# EAGLE design Adafruit Ethernet FeatherWing (EAGLE 6.4)
COMPANY: ADAFRUIT INDUSTRIES; DRAWN: KTOWN; REV: B
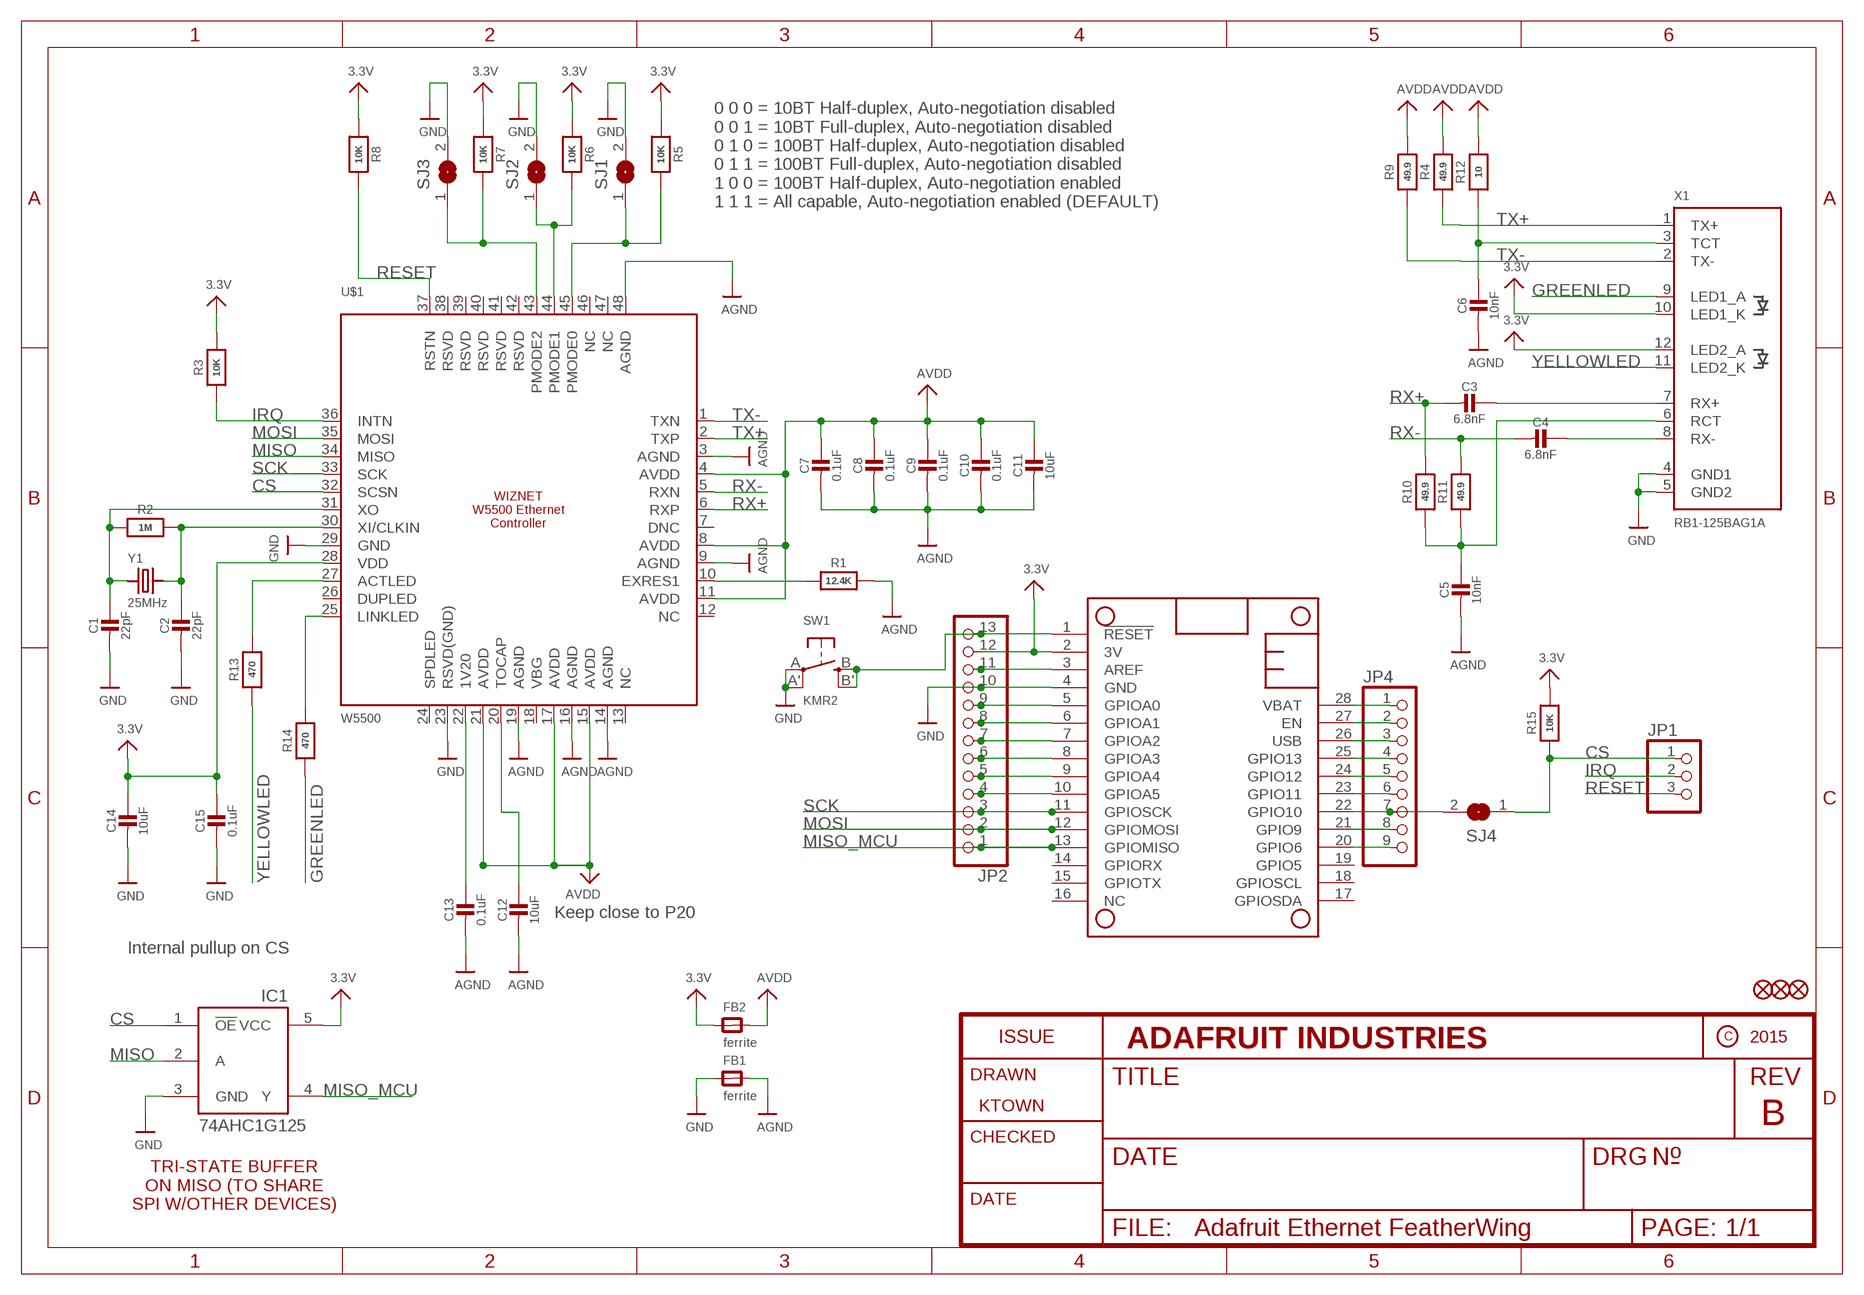
[diagram p0: schematic, sheet 1]

## Parts
C1  22pF  CAP_CERAMIC0603_NO  [0603-NO]
C2  22pF  CAP_CERAMIC0603_NO  [0603-NO]
C3  6.8nF  CAP_CERAMIC0603_NO  [0603-NO]
C4  6.8nF  CAP_CERAMIC0603_NO  [0603-NO]
C5  10nF  CAP_CERAMIC0603_NO  [0603-NO]
C6  10nF  CAP_CERAMIC0603_NO  [0603-NO]
C7  0.1uF  CAP_CERAMIC0603_NO  [0603-NO]
C8  0.1uF  CAP_CERAMIC0603_NO  [0603-NO]
C9  0.1uF  CAP_CERAMIC0603_NO  [0603-NO]
C10  0.1uF  CAP_CERAMIC0603_NO  [0603-NO]
C11  10uF  CAP_CERAMIC0805-NOOUTLINE  [0805-NO]
C12  10uF  CAP_CERAMIC0805-NOOUTLINE  [0805-NO]
C13  0.1uF  CAP_CERAMIC0603_NO  [0603-NO]
C14  10uF  CAP_CERAMIC0805-NOOUTLINE  [0805-NO]
C15  0.1uF  CAP_CERAMIC0603_NO  [0603-NO]
FB1  ferrite  FERRITE-0805NO  [0805-NO]
FB2  ferrite  FERRITE-0805NO  [0805-NO]
FID1  FIDUCIAL""  [FIDUCIAL_1MM]
FID2  FIDUCIAL""  [FIDUCIAL_1MM]
FID3  FIDUCIAL""  [FIDUCIAL_1MM]
IC1  74AHC1G125  [SOT23-5L]
JP1  HEADER-1X376MIL  [1X03_ROUND_76]
JP2  HEADER-1X13  [1X13_ROUND_70]
JP4  HEADER-1X970MIL  [1X09_ROUND_70]
MS1  FEATHERWING_NODIM  [FEATHERWING_NODIM]
R1  12.4K  RESISTOR_0603_NOOUT  [0603-NO]
R2  1M  RESISTOR_0603_NOOUT  [0603-NO]
R3  10K  RESISTOR_0603_NOOUT  [0603-NO]
R4  49.9  RESISTOR_0603_NOOUT  [0603-NO]
R5  10K  RESISTOR_0603_NOOUT  [0603-NO]
R6  10K  RESISTOR_0603_NOOUT  [0603-NO]
R7  10K  RESISTOR_0603_NOOUT  [0603-NO]
R8  10K  RESISTOR_0603_NOOUT  [0603-NO]
R9  49.9  RESISTOR_0603_NOOUT  [0603-NO]
R10  49.9  RESISTOR_0603_NOOUT  [0603-NO]
R11  49.9  RESISTOR_0603_NOOUT  [0603-NO]
R12  10  RESISTOR_0603_NOOUT  [0603-NO]
R13  470  RESISTOR_0603_NOOUT  [0603-NO]
R14  470  RESISTOR_0603_NOOUT  [0603-NO]
R15  10K  RESISTOR_0603_NOOUT  [0603-NO]
SJ1  SOLDERJUMPERREFLOW_NOPASTE  [SOLDERJUMPER_REFLOW_NOPASTE]
SJ2  SOLDERJUMPERREFLOW_NOPASTE  [SOLDERJUMPER_REFLOW_NOPASTE]
SJ3  SOLDERJUMPERREFLOW_NOPASTE  [SOLDERJUMPER_REFLOW_NOPASTE]
SJ4  SOLDERJUMPERCLOSED  [SOLDERJUMPER_CLOSEDWIRE]
SW1  KMR2  SWITCH_TACT_SMT4.6X2.8  [BTN_KMR2_4.6X2.8]
U$1  W5500  WIZNET_W5500  [LQFP48]
X1  RB1-125BAG1A  RJ45J0026D21BNL  [RJ45_PULSEJACK]
Y1  25MHz  CRYSTAL3.2X2.5  [CRYSTAL_3.2X2.5]

## Nets
3.3V: C14.1 C15.1 FB2.1 IC1.5(VCC) JP2.12 MS1.2(3V) R3.2 R5.1 R6.1 R7.1 R8.1 R15.2 U$1.28(VDD) X1.10(LED1_K) X1.12(LED2_A)
AGND: C5.2 C6.2 C7.2 C8.2 C9.2 C10.2 C11.2 C12.2 C13.2 FB1.2 R1.2 U$1.3(AGND) U$1.9(AGND) U$1.14(AGND) U$1.16(AGND) U$1.19(AGND) U$1.48(AGND)
AVDD: C7.1 C8.1 C9.1 C10.1 C11.1 FB2.2 R4.2 R9.2 R12.2 U$1.4(AVDD) U$1.8(AVDD) U$1.11(AVDD) U$1.15(AVDD) U$1.17(AVDD) U$1.21(AVDD)
CS: IC1.1(!OE) JP1.1 R15.1 SJ4.1 U$1.32(SCSN)
GND: C1.2 C2.2 C14.2 C15.2 FB1.1 IC1.3(GND) JP2.10 MS1.4(GND) SJ1.2 SJ2.2 SJ3.2 SW1.A'(P1) SW1.A(P) U$1.23(RSVD(GND)) U$1.29(GND) X1.4(GND1) X1.5(GND2)
GREENLED: R14.1 X1.9(LED1_A)
IRQ: JP1.2 R3.1 U$1.36(INTN)
MISO: IC1.2(A) U$1.34(MISO)
MISO_MCU: IC1.4(Y) JP2.1 MS1.13(GPIOMISO)
MOSI: JP2.2 MS1.12(GPIOMOSI) U$1.35(MOSI)
N$1: C1.1 R2.1 U$1.31(XO) Y1.1
N$2: C2.1 R2.2 U$1.30(XI/CLKIN) Y1.2
N$3: R1.1 U$1.10(EXRES1)
N$4: R5.2 SJ1.1 U$1.45(PMODE0)
N$5: R6.2 SJ2.1 U$1.44(PMODE1)
N$6: R7.2 SJ3.1 U$1.43(PMODE2)
N$7: C3.1 X1.7(RX+)
N$8: C4.1 X1.8(RX-)
N$9: C5.1 R10.1 R11.1 X1.6(RCT)
N$10: C6.1 R12.1 X1.3(TCT)
N$11: C13.1 U$1.22(1V20)
N$12: C12.1 U$1.20(TOCAP)
N$13: R13.2 U$1.27(ACTLED)
N$14: R14.2 U$1.25(LINKLED)
N$15: JP4.2 MS1.27(EN)
N$16: JP4.4 MS1.25(GPIO13)
N$17: JP4.5 MS1.24(GPIO12)
N$18: JP4.6 MS1.23(GPIO11)
N$19: JP4.7 MS1.22(GPIO10) SJ4.2
N$20: JP4.8 MS1.21(GPIO9)
N$21: JP4.9 MS1.20(GPIO6)
N$22: JP2.13 MS1.1(!RESET) SW1.B'(S1) SW1.B(S)
N$28: JP2.4 MS1.10(GPIOA5)
N$29: JP2.5 MS1.9(GPIOA4)
N$30: JP2.6 MS1.8(GPIOA3)
N$31: JP2.7 MS1.7(GPIOA2)
N$32: JP2.8 MS1.6(GPIOA1)
N$33: JP2.9 MS1.5(GPIOA0)
N$34: JP2.11 MS1.3(AREF)
RESET: JP1.3 R8.2 U$1.37(RSTN)
RX+: C3.2 R10.2 U$1.6(RXP)
RX-: C4.2 R11.2 U$1.5(RXN)
SCK: JP2.3 MS1.11(GPIOSCK) U$1.33(SCK)
TX+: R4.1 U$1.2(TXP) X1.1(TX+)
TX-: R9.1 U$1.1(TXN) X1.2(TX-)
USB: JP4.3 MS1.26(USB)
VBAT: JP4.1 MS1.28(VBAT)
YELLOWLED: R13.1 X1.11(LED2_K)
Unconnected: MS1.14(GPIORX) MS1.15(GPIOTX) MS1.16(NC) MS1.17(GPIOSDA) MS1.18(GPIOSCL) MS1.19(GPIO5) U$1.7(DNC) U$1.12(NC) U$1.13(NC) U$1.18(VBG) U$1.24(SPDLED) U$1.26(DUPLED) U$1.38(RSVD) U$1.39(RSVD) U$1.40(RSVD) U$1.41(RSVD) U$1.42(RSVD) U$1.46(NC) U$1.47(NC)

## Notes on the sheet
- 0 0 0 = 10BT Half-duplex, Auto-negotiation disabled
  0 0 1 = 10BT Full-duplex, Auto-negotiation disabled
  0 1 0 = 100BT Half-duplex, Auto-negotiation disabled
  0 1 1 = 100BT Full-duplex, Auto-negotiation disabled
  1 0 0 = 100BT Half-duplex, Auto-negotiation enabled
  1 1 1 = All capable, Auto-negotiation enabled (DEFAULT)
- Keep close to P20
- Internal pullup on CS
- TRI-STATE BUFFER
  ON MISO (TO SHARE
  SPI W/OTHER DEVICES)

## Library data of the parts
C1-C15 = microbuilder:CAP_CERAMIC: Ceramic Capacitors For new designs, use the packages preceded by an '_' character since they are more reliable: The following footprints should be used on most boards: _0402 - Standard footprint for regular board layouts _0603 - Standard footprint for regular board layouts _0805 - Standard footprint for regular board layouts _1206 - Standard footprint for regular board layouts For extremely tight-pitch boards where space is at a premium, the following 'micro-pitch' footprints can be used (smaller pads, no silkscreen outline, etc.): _0402MP - Micro-pitch footprint for very dense/compact boards _0603MP - Micro-pitch footprint for very dense/compact boards _0805MP - Micro-pitch footprint for very dense/compact boards _1206MP - Micro-pitch footprint for very dense/compact boards
FB1 FB2 = microbuilder:FERRITE: Ferrite Bead 0603 MMZ1608B121C - 120 Ohm @ 100MHz, 600mA, 0.15 Ohm DC Resistance - Digikey: 445-2164-1-ND BK1608HW121-T - 120 Ohm, 600mA Ferrite Chip - Digikey: 587-1876-2-ND 0805 HZ0805B272R-10 - 2.7K Ohm @ 100MHz, 200mA, 0.8 Ohm DC Resistance - Digikey: 240-2504-1-ND (see also Murata BLM21BD272SN1L) MMZ2012Y152B - 1.5K Ohm @ 100MHz, 500mA, 0.4 Ohm DC Resistance - Digikey: 445-1560-1-ND - Mainly for high frequency (80-400MHz) MMZ2012R102A - 1K Ohm @ 100MHz, 500mA, 0.3 Ohm DC Resistance - Digikey: 445-1555-2-ND - More general purpose (10-200MHz)
FID1-FID3 = microbuilder:FIDUCIAL: Fiducial Alignment Points Various fiducial points for machine vision alignment.; BOM: EXCLUDE
IC1 = adafruit:74AHC1G125
JP1 = microbuilder:HEADER-1X3: PIN HEADER
JP2 = microbuilder:HEADER-1X13
JP4 = microbuilder:HEADER-1X9: PIN HEADER
MS1 = microbuilder:FEATHERWING
R1-R15 = microbuilder:RESISTOR: Resistors For new designs, use the packages preceded by an '_' character since they are more reliable: The following footprints should be used on most boards: _0402 - Standard footprint for regular board layouts _0603 - Standard footprint for regular board layouts _0805 - Standard footprint for regular board layouts _1206 - Standard footprint for regular board layouts For extremely tight-pitch boards where space is at a premium, the following 'micro-pitch' footprints can be used (smaller pads, no silkscreen outline, etc.): _0402MP - Micro-pitch footprint for very dense/compact boards _0603MP - Micro-pitch footprint for very dense/compact boards _0805MP - Micro-pitch footprint for very dense/compact boards _1206MP - Micro-pitch footprint for very dense/compact boards
SJ1-SJ4 = microbuilder:SOLDERJUMPER: SMD Solder JUMPER Solder the two pads together to create a connection, or remove the solder to break it. REFLOW - Use this footprint for solder paste and reflow ovens. WAVE - Use this footprint for hand-soldering (larger pads). CLOSED - Has a trace between the two pads to ensure it is closed by default. The trace needs to be cut to disable the jumper, and can be closed again by creating a solder bridge between the two pads.
SW1 = microbuilder:SWITCH_TACT_SMT: SMT Tact Switches 6x6mm - Digikey: P12940SCT-ND KMR2 (4.6x2.8mm) - Digikey: 401-1426-1-ND EVQ-PQHB55 - Light Touch, 160GF (4.5x4.5mm) - Digikey: P8090SCT-ND KMT0 - KMT021 NGJ LHS (etc.) IP68/Waterproof - Digikey: CKN10289CT-ND
U$1 = microbuilder:WIZNET_W5500: WIZNET W5500 Ethernet Controller 3.3V IO with 5V tolerant pins
X1 = microbuilder:RJ45: RJ45 (Ethernet) Connectors J0026D21BNL - RJ45 Connector with internal transformer and 2 LEDs (Yellow/Green). LEDs have max foreward-voltage of 2.5V. LEDs require an external resistor. Digikey: 553-1349-ND J00-0065NL - RJ45 Connector with internal transformer and 2 LEDs (Yellow/Green). LEDs have max foreward-voltage of 2.5V. LEDs require an external resistor. Digikey: 553-1345-ND
Y1 = microbuilder:CRYSTAL: Crystals HC49UP - Surface Mount Crystal 4.0MHz 18pF +/-30ppm Surface Mount Crystal [Digikey: 535-9857-1-ND] 12.0 MHz Surface Mount Crystal [Digikey: 535-9869-6-ND] 25.0 MHz Surface Mount Crystal [Digikey: 535-9078-1-ND] 2.5 x 2.0mm - MEMs SMT Crystal 16.0 MHz 10pF 20ppm 2.5 x 2.0mm Crystal [Digikey -40-85°C: 535-10923-1-ND] 3.2 x 2.5mm - MEMs SMT Crystal 12.0 MHz 8pF 15ppm 3.2 x 2.5mm Crystal [Digikey: -10-70°C: 644-1047-1-ND -40-125°C: 644-1128-1-ND] 40~85°C cheaper: 644-1173-6-ND 16.0 MHz 8pF 15ppm 3.2 x 2.5mm Crystal [Digikey: -10-70°C: 644-1049-1-ND -40-125°C: 644-1129-2-ND]-40~85°C cheaper: 644-1175-6-ND 16.0 MHz 10pF 10ppm 3.2 x 2.5mm Crystal [Digikey: 644-1100-1-ND] 27.12 MHz 18pF 30ppm 3.2 x 2.5mm Crystal [Digikey: 887-1424-1-ND] 27.12MHz 10pF 10ppm 3.2 x 2.5mm Crystal [Digikey: 887-1329-1-ND] 4.9 x 1.8mm - MEMs SMT Crystal 32.768 KHz 12.5pF 20ppm 4.9 x 1.8mm Crystal [Digikey: SE2415CT-ND] 8.0 x 3.8mm - Surface Mount Crystal 32.768kHz 12.5pF 20ppm -40°C-85°C [Digikey: 535-9166-2-ND] Cylinder 32.768KHz Cylinder Crystal (2x6mm body) [Ex. Digikey: 300-8341-2-ND]

## Board
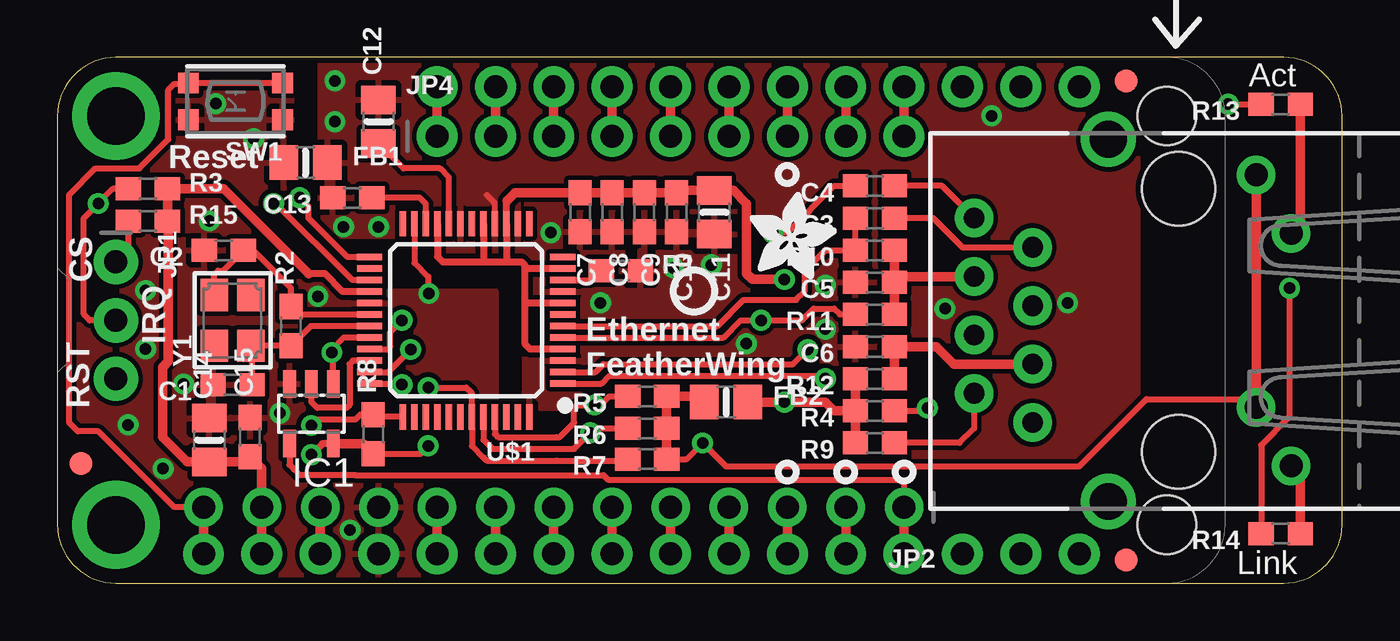
[diagram p1: board, top side]
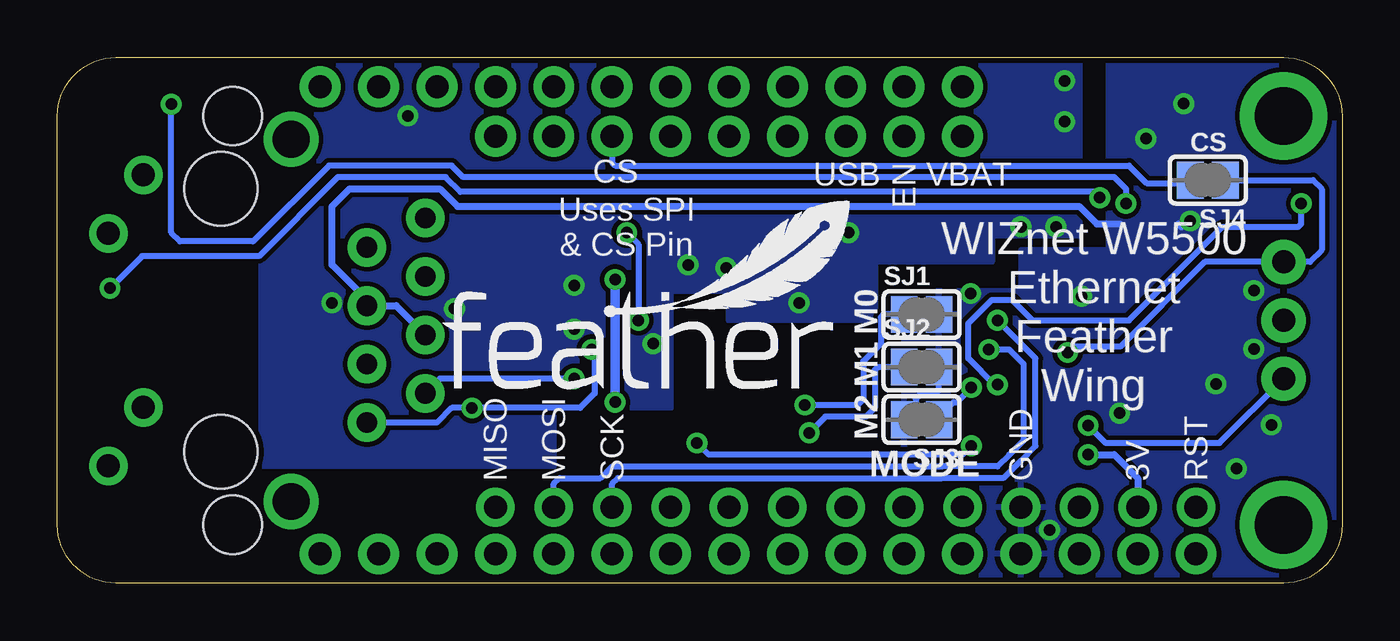
[diagram p2: board, bottom side, seen from below]

Size 55.88 x 22.86 mm. Coordinates in mm from the lower left corner, seen from the top.
Outline: 0,20.32 0,2.54 arc90 2.54,0 53.34,0 arc90 55.88,2.54 55.88,20.32 arc90 53.34,22.86 2.54,22.86 arc90 0,20.32
Copper layers (1*16): Top 0.035mm / dielectric 1.5mm / Bottom 0.035mm
Design rules "adafruit *": minimum track width 8mil, minimum drill 15.5mil, track to track 8mil, track to pad 8mil, pad to pad 8mil, via to via 8mil, smd to smd 8mil, copper to edge 10mil, drill to drill 8mil, minimum pad ring 10mil, minimum via ring 8mil, stop-mask expansion 2mil, vias tented up to drill 20mil, thermal gap 10mil

### Footprints (pad centres in the part's own frame; a part is rotated, then mirrored left to right if it is on the bottom)
0603-NO = smd 1.1 x 1: 1 -0.85,0; 2 0.85,0
0805-NO = smd 1.24 x 1.5: 1 -0.95,0; 2 0.95,0
FIDUCIAL_1MM = smd 1 x 1: 1 0,0
SOT23-5L = smd 0.55 x 1.2: 1 -0.95,-1.3; 2 0,-1.3; 3 0.95,-1.3; 4 0.95,1.3; 5 -0.95,1.3
1X03_ROUND_76 = drill 1 pad 1.93: 1 -2.54,0; 2 0,0; 3 2.54,0
1X13_ROUND_70 = drill 1 pad 1.676: 1 -15.24,0; 2 -12.7,0; 3 -10.16,0; 4 -7.62,0; 5 -5.08,0; 6 -2.54,0; 7 0,0; 8 2.54,0; 9 5.08,0; 10 7.62,0; 11 10.16,0; 12 12.7,0; 13 15.24,0
1X09_ROUND_70 = drill 1 pad 1.778: 1 -10.16,0; 2 -7.62,0; 3 -5.08,0; 4 -2.54,0; 5 0,0; 6 2.54,0; 7 5.08,0; 8 7.62,0; 9 10.16,0
FEATHERWING_NODIM = drill 1 pad 1.778: 1 6.35,1.27; 2 8.89,1.27; 3 11.43,1.27; 4 13.97,1.27; 5 16.51,1.27; 6 19.05,1.27; 7 21.59,1.27; 8 24.13,1.27; 9 26.67,1.27; 10 29.21,1.27; 11 31.75,1.27; 12 34.29,1.27; 13 36.83,1.27; 14 39.37,1.27; 15 41.91,1.27; 16 44.45,1.27; 17 44.45,21.59; 18 41.91,21.59; 19 39.37,21.59; 20 36.83,21.59; 21 34.29,21.59; 22 31.75,21.59; 23 29.21,21.59; 24 26.67,21.59; 25 24.13,21.59; 26 21.59,21.59; 27 19.05,21.59; 28 16.51,21.59 | drill 2.5 pad 3.81: P$1 2.54,20.32; P$2 2.54,2.54 | hole 2.54: 48.26,20.32; 48.26,2.54
SOLDERJUMPER_REFLOW_NOPASTE = smd 1.168 x 1.6: 1 -0.762,0; 2 0.762,0
SOLDERJUMPER_CLOSEDWIRE = smd 1.168 x 1.6: 1 -0.762,0; 2 0.762,0 | smd 0.635 x 0.203: WIRE 0,0
BTN_KMR2_4.6X2.8 = smd 0.9 x 0.9: A 2.05,0.8; A' -2.05,0.8; B 2.05,-0.8; B' -2.05,-0.8
LQFP48 = smd 1.1 x 0.285: 1 -4.2,2.75; 2 -4.2,2.25; 3 -4.2,1.75; 4 -4.2,1.25; 5 -4.2,0.75; 6 -4.2,0.25; 7 -4.2,-0.25; 8 -4.2,-0.75; 9 -4.2,-1.25; 10 -4.2,-1.75; 11 -4.2,-2.25; 12 -4.2,-2.75; 25 4.2,-2.75; 26 4.2,-2.25; 27 4.2,-1.75; 28 4.2,-1.25; 29 4.2,-0.75; 30 4.2,-0.25; 31 4.2,0.25; 32 4.2,0.75; 33 4.2,1.25; 34 4.2,1.75; 35 4.2,2.25; 36 4.2,2.75 | smd 0.285 x 1.1: 13 -2.75,-4.2; 14 -2.25,-4.2; 15 -1.75,-4.2; 16 -1.25,-4.2; 17 -0.75,-4.2; 18 -0.25,-4.2; 19 0.25,-4.2; 20 0.75,-4.2; 21 1.25,-4.2; 22 1.75,-4.2; 23 2.25,-4.2; 24 2.75,-4.2; 37 2.75,4.2; 38 2.25,4.2; 39 1.75,4.2; 40 1.25,4.2; 41 0.75,4.2; 42 0.25,4.2; 43 -0.25,4.2; 44 -0.75,4.2; 45 -1.25,4.2; 46 -1.75,4.2; 47 -2.25,4.2 | smd 0.28 x 1.1: 48 -2.75,4.2
RJ45_PULSEJACK = drill 0.9 pad 1.676: 1 4.445,-6.35; 2 3.175,-8.89; 3 1.905,-6.35; 4 0.635,-8.89; 5 -0.635,-6.35; 6 -1.905,-8.89; 7 -3.175,-6.35; 8 -4.445,-8.89 | drill 1 pad 1.676: 9 6.325,4.9; 10 3.785,3.38; 11 -3.785,4.9; 12 -6.325,3.38 | drill 1.6: P$5 -7.875,-3.05; P$6 7.875,-3.05 | hole 3.2: -5.715,0; 5.715,0
CRYSTAL_3.2X2.5 = smd 1.4 x 1.2: 1 -1.1,-0.8; 2 1.1,0.8; GND1 -1.1,0.8; GND2 1.1,-0.8

### Placement (x,y rotation side)
C1  7.62,8.64 180 top
C2  7.24,14.48 180 top
C3  35.56,15.88 180 top
C4  35.56,17.27 180 top
C5  35.56,13.08 180 top
C6  35.56,10.29 180 top
C7  22.73,16.13 270 top
C8  24.13,16.13 270 top
C9  25.53,16.13 270 top
C10  26.92,16.13 270 top
C11  28.57,16.13 270 top
C12  13.97,20.07 90 top
C13  12.83,16.76 180 top
C14  6.6,6.22 90 top
C15  8.38,6.35 90 top
FB1  10.79,18.29 0 top
FB2  29.08,7.87 0 top
FID1  46.48,1.02 0 top
FID2  1.02,5.21 0 top
FID3  46.48,21.84 0 top
IC1  11.05,7.37 180 top
JP1  2.54,11.43 270 top
JP2  21.59,3.3 180 top
JP4  26.67,19.43 0 top
MS1  0,0 0 top
R1  24.51,13.59 0 top
R2  10.16,11.18 90 top
R3  3.94,17.14 0 top
R4  35.56,7.49 180 top
R5  25.65,8.13 180 top
R6  25.65,6.73 180 top
R7  25.65,5.4 180 top
R8  13.74,6.48 90 top
R9  35.56,6.1 180 top
R10  35.56,14.48 180 top
R11  35.56,11.68 180 top
R12  35.56,8.89 180 top
R13  53.21,20.83 180 top
R14  53.21,2.16 180 top
R15  3.94,15.75 0 top
SJ1  18.29,11.68 0 bottom
SJ2  18.29,9.4 0 bottom
SJ3  18.29,7.11 180 bottom
SJ4  5.84,17.53 180 bottom
SW1  7.75,20.95 180 top
U$1  17.78,11.43 180 top
U$45  [PCBFEAT-REV-040]  27.69,12.7 0 top
U$48  [FEATHERLOGO_MED]  39.24,8.38 0 bottom
U$49  [ADAFRUIT_3.5MM]  30.1,13.21 0 top
X1  48.77,11.43 270 top
Y1  7.62,11.43 90 top

### Tracks (layer width: path | path; a pad name or v marks a point on that pad's centre or on a via)
3.3V  (via drill 0.5)
  Top 0.254: R8.1 15.79,5.63 v16.13,5.97 | R7.1 27.37,5.4 v28.07,6.1 29.08,5.08 44.45,5.08 47.37,8 51.79,8 X1.10
  Top 0.305: U$1.28 12.41,12.68 11.63,13.46 10.92,13.46 | IC1.5 11.53,6.07 v11.05,5.59
  Top 0.406: MS1.2 JP2.12 8.89,4.99 C15.1 8.15,5.27 C14.1 5.65,5.27 4.57,6.35 4.57,9.4 4.83,9.65 4.83,15.71 R15.2 R3.2 7.24,17.14 10.92,13.46 | X1.12 X1.10 | R7.1 R6.1 R5.1 27.88,8.13 FB2.1 | IC1.5 13.3,6.07 R8.1
  Bottom 0.254: v16.13,5.97 16.51,5.59 27.56,5.59 v28.07,6.1
  Bottom 0.305: v11.05,5.59 9.91,5.59 8.89,4.57 JP2.12
AGND  (via drill 0.5)
  Top 0.254: U$1.16 19.03,16.53 18.67,16.89
  other vias: 21.46,15.24 28.45,13.84 43.94,12.19 38.61,11.94 12.45,15.49 13.97,15.49 33.4,11.05 33.4,12.95 29.97,10.41 26.8,13.72 40.64,20.32 12.06,20.07 23.62,12.19 12.06,21.84
  pour Top (isolate 0.203): 11.43,22.86 11.43,15.11 15.24,15.11 15.24,13.97 20.32,13.97 20.32,7.62 31.75,7.62 31.75,5.08 46.99,5.08 46.99,22.86
  pour Bottom: 11.43,22.86 11.43,15.11 15.24,15.11 15.24,13.97 20.32,13.97 20.32,11.43 26.67,11.43 26.67,12.7 29.21,12.7 29.21,7.62 34.29,7.62 34.29,5.08 46.99,5.08 46.99,22.86
AVDD  (via drill 0.5)
  Top 0.305: 19.56,16.64 19.53,16.61 U$1.15 19.53,14 19.56,13.97 | U$1.21 16.53,14.2 16.76,13.97 18.54,13.97 | 18.54,13.97 19.56,13.97 | 19.56,13.97 20.19,13.97 20.32,13.84 20.32,13.72 | 20.32,13.72 20.32,12.19 | 20.32,12.19 20.32,10.41 20.55,10.18 U$1.4 | U$1.8 20.33,12.18 20.32,12.19 | U$1.11 20.36,13.68 20.32,13.72 | U$1.17 18.53,13.98 18.54,13.97
  Top 0.406: R9.2 R4.2 | R4.2 R12.2 | 19.56,16.64 19.9,16.98 C7.1 C8.1 C9.1 C10.1 27.02,17.08 C11.1 29.4,17.08 29.97,16.51 29.97,13.46 30.23,13.21 v31.62,13.21 | FB2.2 v31.62,7.87 33.4,7.87 33.78,7.49 R4.2
  Bottom 0.406: v31.62,13.21 v31.62,7.87
CS  (via drill 0.5)
  Top 0.254: U$1.32 12.46,10.68 11.94,10.16 v11.94,10.03 12,9.97 IC1.1 | R15.1 3.09,14.52 JP1.1
  Bottom 0.254: v11.94,10.03 11.68,10.29 9.65,10.29 5.97,13.97 JP1.1 1.4,13.97 0.89,14.48 0.89,17.14 1.27,17.53 SJ4.1
GND  (via drill 0.5)
  Top 0.254: U$1.23 15.53,13.93 16.13,13.34 16.13,12.62 v16.15,12.6
  Bottom 0.254: 19.05,7.37 SJ3.2 18.54,7.62 18.54,8 18.29,8.26 17.65,8.26 17.53,8.38 SJ2.2
  Bottom 0.305: 6.99,15.49 7.11,15.62 | 9.65,15.62 10.67,15.62 11.43,16.38 38.48,16.38 39.24,17.14 43.18,17.14 43.94,16.38 43.94,13.84 42.42,12.32 X1.5 41.15,12.06 X1.4
  other vias: 6.6,15.75 11.33,12.47 6.88,20.85 8.53,19.33 12.73,2.31 3.07,6.88 9.68,7.39 3.84,12.73 4.6,4.98 5.49,8.66 3.84,10.19
  pour Top (isolate 0.203): 10.16,22.86 10.16,14.48 13.97,14.48 13.97,12.7 19.05,12.7 19.05,6.35 30.48,6.35 30.48,3.81 46.99,3.81 46.99,0 0,0 0,22.86
  pour Bottom: 0,0 0,22.86 10.16,22.86 10.16,14.48 13.97,14.48 13.97,12.7 19.05,12.7 19.05,6.35 31.75,6.35 31.75,3.81 55.88,3.81 55.88,0
GREENLED
  Top 0.406: R14.1 54.06,4.71 X1.9
IRQ  (via drill 0.5)
  Top 0.254: U$1.36 14.94,8.68 v14.99,8.64 | v1.78,16.51 2.03,16.76 | JP1.2 1.4,11.43 1.14,11.68 1.14,15.88 v1.78,16.51 | R3.1 2.41,17.14 v1.78,16.51
  Bottom 0.254: v14.99,8.64 15.11,8.64 16.26,9.78 16.26,11.3 15.24,12.32 14.35,12.32 13.46,11.43 9.27,11.43 5.21,15.49 1.91,15.49 1.78,15.62 v1.78,16.51
MISO
  Top 0.254: U$1.34 12.86,9.68 12.7,9.53 12.7,7.75 12.57,7.62 11.3,7.62 11.05,7.87 IC1.2
MISO_MCU
  Top 0.254: IC1.4 10.1,5.14 10.29,4.95 10.54,4.7 12.95,4.7 23.75,4.7 23.94,4.51 36.64,4.51 36.83,4.32 JP2.1
  Top 0.406: MS1.13 JP2.1
MOSI  (via drill 0.5)
  Top 0.254: U$1.35 14.39,9.18 14.73,9.53 v15.37,10.16
  Top 0.406: MS1.12 JP2.2
  Bottom 0.254: JP2.2 34.29,4.32 34.04,4.57 32.26,4.57 31.75,5.08 17.4,5.08 14.99,5.08 14.48,5.59 13.84,6.22 13.84,9.53 | 13.84,9.53 14.1,9.78 | 13.84,9.53 14.48,10.16 v15.37,10.16
N$1
  Top 0.254: U$1.31 11.01,11.18 R2.1 8.55,10.33 8.42,10.2 Y1.1 8.47,10.28 C1.1
N$2
  Top 0.254: U$1.30 10.51,11.68 R2.2 10.16,12.83 8.51,14.48 C2.1 7.2,13.59 6.99,13.59 6.82,13.42 Y1.2
N$3
  Top 0.254: U$1.10 23.25,13.18 R1.1
N$4  (via drill 0.5)
  Top 0.254: U$1.45 19.03,6.5 19.18,6.35 21.72,6.35 21.84,6.35 22.48,6.99 22.48,7.62 22.61,7.75 v23.37,7.75 23.62,7.75 24,8.13 R5.2
  Bottom 0.254: SJ1.1 19.94,11.68 20.07,11.56 20.07,10.41 20.83,9.65 20.83,8 21.08,7.75 22.23,7.75 v23.37,7.75
N$5  (via drill 0.5)
  Top 0.254: U$1.44 18.53,6.24 18.92,5.84 19.05,5.84 21.72,5.84 22.48,5.84 v23.18,6.54 23.37,6.73 R6.2
  Bottom 0.254: SJ2.1 20.19,9.4 20.32,9.27 20.32,7.62 20.7,7.24 22.48,7.24 v23.18,6.54
N$6  (via drill 0.5)
  Top 0.254: v16.13,8.51 17.78,8.51 17.91,8.38 18.03,8.26 U$1.43 18.03,5.97 18.54,5.46 18.67,5.33 21.72,5.33 24.74,5.33 R7.2
  Bottom 0.254: SJ3.1 17.53,7.24 16.89,7.87 16.76,7.87 v16.13,8.51
N$7
  Top 0.254: X1.7 39.37,14.61 38.1,15.88 C3.1
N$8
  Top 0.254: X1.8 38.48,17.27 C4.1
N$9
  Top 0.406: R10.1 C5.1 | C5.1 R11.1 | C5.1 36.66,13.34 X1.6
N$10
  Top 0.406: R12.1 C6.1 38.23,10.29 38.99,9.53 X1.3
N$11
  Top 0.254: U$1.22 16.03,16.48 15.75,16.76 C13.1
N$12
  Top 0.254: U$1.20 17.03,17.64 16.64,18.03 15.05,18.03 C12.1
N$13  (via drill 0.5)
  Top 0.254: U$1.27 12.83,13.18 9.5,16.51 v9.4,16.51 9.53,16.51 | v50.93,20.83 R13.2
  Bottom 0.254: v50.93,20.83 50.93,15.24 50.55,14.86 47.37,14.86 44.07,18.16 38.73,18.16 38.23,17.65 9.91,17.65 9.4,17.14 v9.4,16.51
N$14  (via drill 0.5)
  Top 0.254: U$1.25 12.62,14.18 10.92,15.88 10.92,16.38 v10.54,16.76 | v53.59,12.83 53.59,7.24 52.36,6.01 R14.2
  Bottom 0.254: v10.54,16.76 10.79,17.02 38.35,17.02 38.99,17.65 43.69,17.65 47.12,14.22 52.2,14.22 v53.59,12.83
N$15
  Top 0.406: MS1.27 JP4.2
N$16
  Top 0.406: MS1.25 JP4.4
N$17
  Top 0.406: MS1.24 JP4.5
N$18
  Top 0.406: MS1.23 JP4.6
N$19
  Top 0.406: MS1.22 JP4.7
  Bottom 0.254: JP4.7 31.75,18.29 31.62,18.16 9.27,18.16 8.51,17.4 6.73,17.4 SJ4.2
N$20
  Top 0.406: MS1.21 34.29,19.94 JP4.8
N$21
  Top 0.406: MS1.20 JP4.9
N$22
  Top 0.254: JP2.13 5.08,3.3 1.78,6.6 0.89,6.6 0.51,6.99 0.51,16.89 1.65,18.03 3.56,18.03 4.83,19.3 4.83,21.46 5.08,21.72 5.66,21.72 SW1.B SW1.B'
  Top 0.406: MS1.1 JP2.13
N$28
  Top 0.406: MS1.10 JP2.4
N$29
  Top 0.406: MS1.9 JP2.5
N$30
  Top 0.406: MS1.8 JP2.6
N$31
  Top 0.406: MS1.7 JP2.7
N$32
  Top 0.406: MS1.6 JP2.8
N$33
  Top 0.406: MS1.5 JP2.9
N$34
  Top 0.406: MS1.3 JP2.11
RESET  (via drill 0.5)
  Top 0.254: U$1.37 13.84,7.23 R8.2 13.17,7.33 12.95,7.11 11.3,7.11 v11.05,6.86
  Bottom 0.254: v11.05,6.86 10.29,6.1 5.33,6.1 JP1.3
RX+
  Top 0.254: C3.2 R10.2 33.4,14.48 32.51,13.59 32.51,12.7 32.13,12.32 29.84,12.32 28.71,11.18 U$1.6
RX-  (via drill 0.5)
  Top 0.254: R11.2 34.04,11.68 33.78,11.94 32.89,11.94 32.38,11.43 v30.61,11.43 29.72,11.43 28.97,10.68 U$1.5 | v31.11,15.24 31.75,15.24 33.78,17.27 C4.2
  Bottom 0.254: v31.11,15.24 30.61,14.73 v30.61,11.43
SCK  (via drill 0.5)
  Top 0.254: U$1.33 14.37,10.18 14.48,10.29 14.48,10.92 v14.99,11.43
  Top 0.406: MS1.11 JP2.3
  Bottom 0.254: JP2.3 31.75,4.32 31.5,4.57 17.4,4.57 14.73,4.57 13.97,5.33 13.34,5.97 13.34,9.78 v14.99,11.43
TX+  (via drill 0.5)
  Top 0.254: U$1.2 23.4,9.18 23.75,9.53 32,9.53 v32.64,10.16 | R4.1 37.72,7.49 v37.85,7.62
  Bottom 0.254: X1.1 39.37,6.99 38.73,7.62 v37.85,7.62 33.15,7.62 32.51,8.26 32.51,10.03 v32.64,10.16
TX-  (via drill 0.5)
  Top 0.254: U$1.1 23.67,8.68 24,9.02 33.27,9.02 v33.4,8.89 | X1.2 39.88,6.73 39.24,6.1 R9.1
  Bottom 0.254: v33.4,8.89 39.24,8.89 X1.2
USB
  Top 0.406: MS1.26 JP4.3
VBAT
  Top 0.406: MS1.28 JP4.1
YELLOWLED
  Top 0.406: R13.1 54.06,15.61 X1.11

### Text on the board
tPlace: 4 x Not Plated Holes | Act | Reset | CS | IRQ | Ethernet / FeatherWing | RST | Link
bPlace: CS | VBAT | EN | USB | CS | Uses SPI / & CS Pin | WIZnet W5500 / Ethernet / Feather / Wing | M0 | M1 | M2 | MODE | RST | 3V | GND | SCK | MOSI | MISO